# EAGLE design untitled (EAGLE 9.1.3)
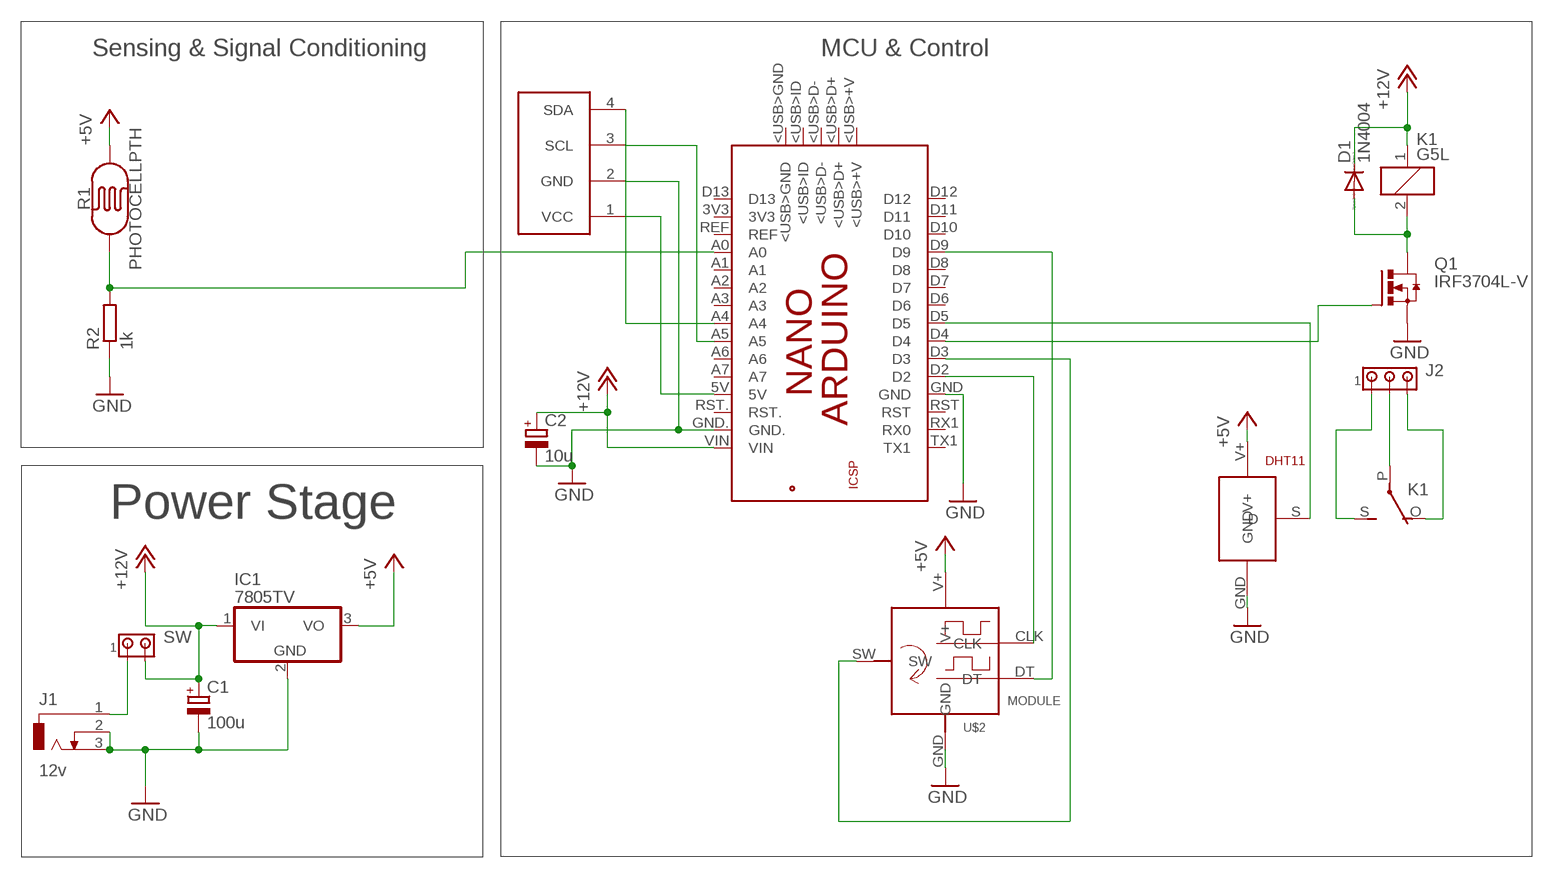
[diagram p0: schematic, sheet 1]

## Parts
C1  100u  CPOL-EUE3.5-8  [E3,5-8]
C2  10u  CPOL-EUE3.5-8  [E3,5-8]
D1  1N4004  [DO41-10]
DHT11  DHT11  [DHT11]
IC1  7805TV  [TO220V]
J1  12v  DCJ0303  [DCJ0303]
J2  MTA03-156  [1X3MTA]
K1  G5L  [G5LE]
PCB1  ARDUINO_NANO  [ARDUINO_NANO]
Q1  IRF3704L-V  [TO262-V]
R1  PHOTOCELLPTH  [PHOTOCELL]
R2  1k  R-EU_0207/7  [0207/7]
SW  MTA02-156  [1X2MTA]
U$1  I2C_OLED  [I2C_OLED_PACKAGE]
U$2  MODULE  [MODULE/SHEILD]

## Nets
+5V: DHT11.V+ IC1.3(VO) R1.2 U$2.V+
+12V: C1.+ C2.+ D1.C IC1.1(VI) K1.1 PCB1.VIN SW.2
GND: C1.- C2.- DHT11.GND IC1.2(GND) J1.2 J1.3 PCB1.GND PCB1.GND. Q1.3(S) R2.1 U$1.2(GND) U$2.GND
N$1: PCB1.A0 R1.1 R2.2
N$2: PCB1.A4 U$1.4(SDA)
N$3: PCB1.A5 U$1.3(SCL)
N$4: J1.1 SW.1
N$5: PCB1.D2 U$2.CLK
N$6: J2.1 K1.S(2:S)
N$7: PCB1.D9 U$2.DT
N$8: J2.2 K1.P(2:P)
N$10: J2.3 K1.O(2:O)
N$11: PCB1.D3 U$2.SW
N$12: DHT11.S(D) PCB1.D5
N$13: PCB1.5V U$1.1(VCC)
N$14: D1.A K1.2 Q1.2(D)
N$15: PCB1.D4 Q1.1(G)
Unconnected: PCB1.3V3 PCB1.5V. PCB1.<USB>+V PCB1.<USB>D+ PCB1.<USB>D- PCB1.<USB>GND PCB1.<USB>ID PCB1.A1 PCB1.A2 PCB1.A3 PCB1.A6 PCB1.A7 PCB1.D6 PCB1.D7 PCB1.D8 PCB1.D10 PCB1.D11 PCB1.D12 PCB1.D13 PCB1.GND_ PCB1.MISO PCB1.MOSI PCB1.REF PCB1.RESET.. PCB1.RST PCB1.RST. PCB1.RX1(RX0) PCB1.SCK PCB1.TX1

## Notes on the sheet
- Sensing & Signal Conditioning | MCU & Control
- Power Stage

## Library data of the parts
C1 C2 = rcl:CPOL-EU: POLARIZED CAPACITOR, European symbol; SPICEPREFIX: C
D1 = diode:1N4004: DIODE general purpose rectifier, 1 A; SPICEPREFIX: D
DHT11 = Misc_Sensors:DHT11
IC1 = linear:78*: Positive VOLTAGE REGULATOR Source: http://cache.national.com/ds/LM/LM78L05.pdf http://www.fairchildsemi.com/ds/LM/LM7805.pdf
J1 = con-jack:DCJ0303: DC POWER JACK Source: DCJ0303.pdf; OC_FARNELL: unknown; OC_NEWARK: unknown
J2 = con-amp:MTA03-156: AMP connector
K1 = relay:G5L: RELAY 1 x switch, 10 A/120 V AC, 8 A/30 V ADC, Omron; OC_FARNELL: unknown; OC_NEWARK: unknown; SPICEPREFIX: B
PCB1 = E14_Arduino_revC:ARDUINO_NANO: Device for representing an Arduino Nano board with a footprint in an EAGLE design. Created by Dave Young for Element14. More EAGLE documentation at: http://www.element14.com/community/community/knode/cadsoft_eagle
Q1 = transistor-power:IRF3704: SMPS MOSFET HEXFET® Power MOSFET Source: http://www.irf.com/product-info/datasheets/data/irf3704.pdf; SPICEPREFIX: Q
R1 = SparkFun-Sensors:PHOTOCELL: Photocell (Photodetector, Photo Resistor, CdS) This is a very small light sensor. A photocell changes (also called a photodetector, photo resistor, CdS or photoconductive cell) resistance depending on the amount of light it is exposed to. These little sensors make great ambient light triggers (when light in the room turns on, do something). Datasheet <http://cdn.sparkfun.com/datasheets/Sensors/LightImaging/SEN-09088.pdf> SparkFun Products Mini Photocell <https://www.sparkfun.com/products/9088> (SEN-09088); PROD_ID: COMP-09129; SF_ID: SEN-09088
R2 = rcl:R-EU_: RESISTOR, European symbol; SPICEPREFIX: R
SW = con-amp:MTA02-156: AMP connector
U$1 = DIYMall_OLED:I2C_OLED
U$2 = rotary-encoder:MODULE

## Board
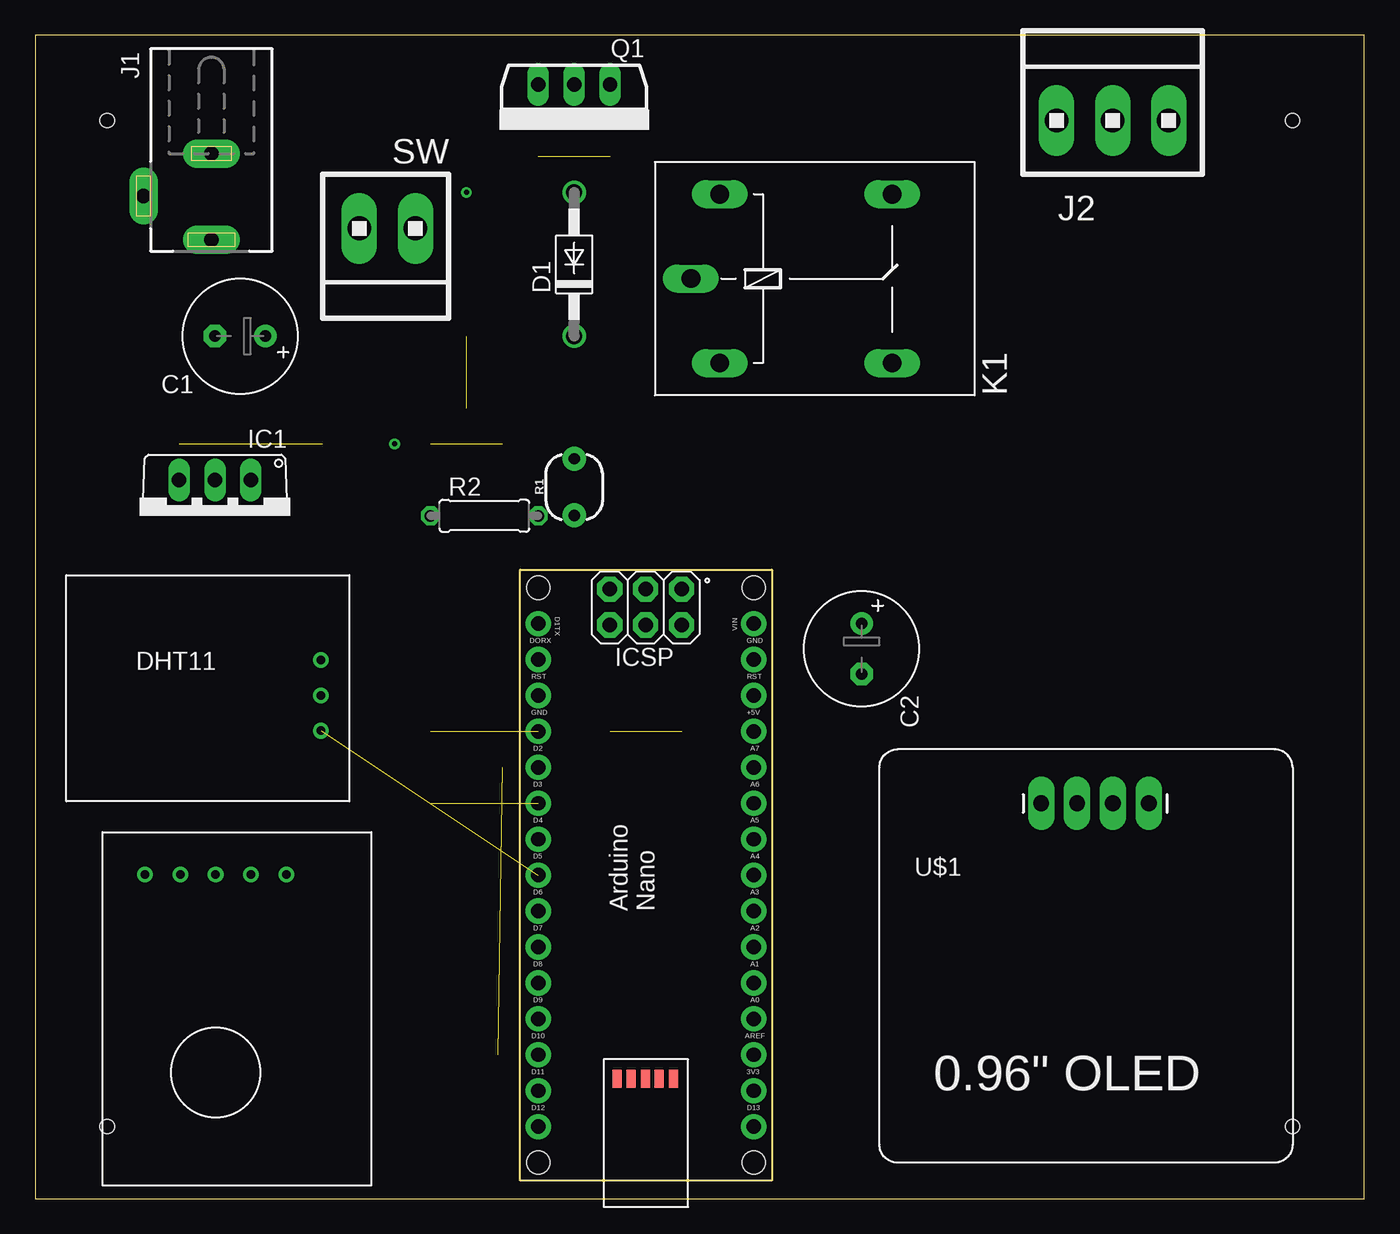
[diagram p1: board, top side]
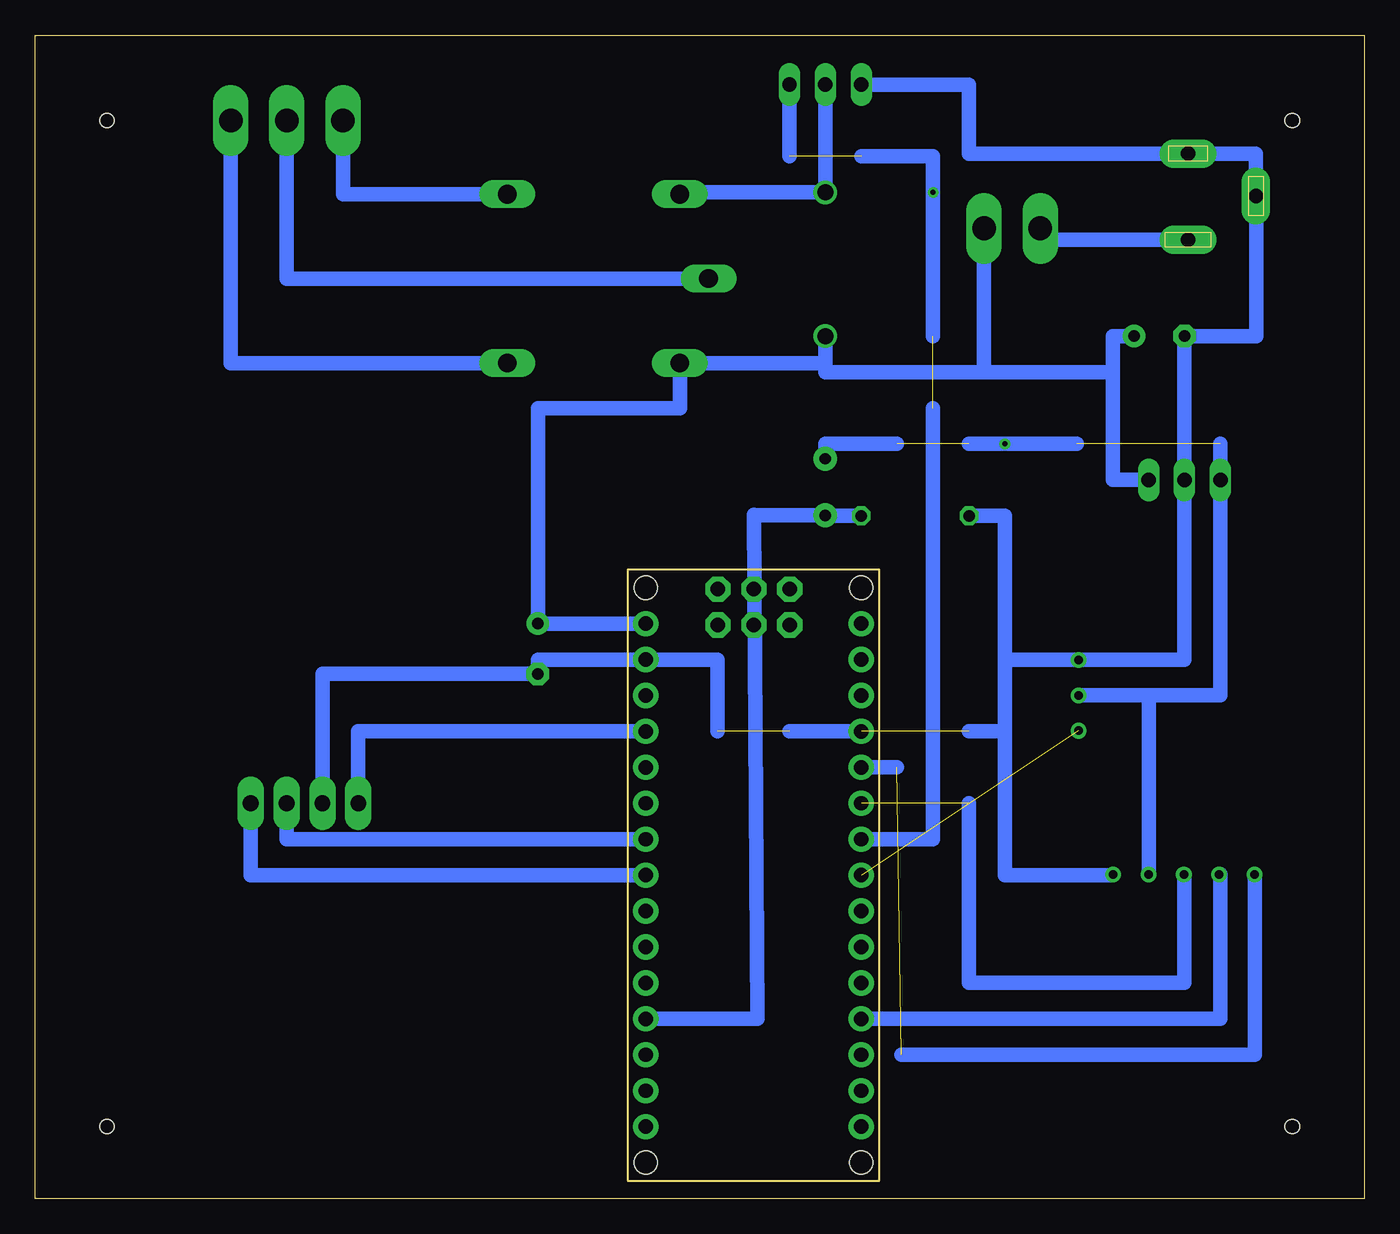
[diagram p2: board, bottom side, seen from below]

Size 93.96 x 82.22 mm. Coordinates in mm from the lower left corner, seen from the top.
Outline: 0,0 93.96,0 93.96,82.22 0,82.22 0,0
Copper layers (1*16): Top 0.035mm / dielectric 1.5mm / Bottom 0.035mm
Design rules "default": minimum track width 6mil, minimum drill 0.35mm, track to track 6mil, track to pad 6mil, pad to pad 6mil, via to via 6mil, smd to smd 6mil, copper to edge 40mil, drill to drill 6mil, minimum pad ring 10mil, minimum via ring 8mil, stop-mask expansion 4mil, vias tented up to drill 0mil, thermal gap 10mil
Holes 1 mm at 88.9,5.08 5.08,5.08 5.08,76.2 88.9,76.2

### Footprints (pad centres in the part's own frame; a part is rotated, then mirrored left to right if it is on the bottom)
E3,5-8 = drill 0.813 pad 1.6: + -1.778,0 | drill 0.813 pad 1.6 octagon: - 1.778,0
DO41-10 = drill 1.118: A 5.08,0; C -5.08,0
DHT11 = drill 0.6: GND 8,2; S 8,-3; V+ 8,-0.5
TO220V = drill 1.016 long: 1 -2.54,-2.54; 2 0,-2.54; 3 2.54,-2.54
DCJ0303 = drill 1 pad 2 long: 1 0,3.1; 2 4.8,0; 3 0,-3
1X3MTA = drill 1.676 long: 1 3.937,0; 2 -0.025,0; 3 -3.988,0
G5LE = drill 1.321 long: 1 -7.493,-5.969; 2 -7.493,5.969; O 4.699,5.969; P -9.525,0; S 4.699,-5.969
ARDUINO_NANO = drill 1.016 pad 1.778: 3V3 6.35,1.27; 5V 31.75,1.27; A0 11.43,1.27; A1 13.97,1.27; A2 16.51,1.27; A3 19.05,1.27; A4 21.59,1.27; A5 24.13,1.27; A6 26.67,1.27; A7 29.21,1.27; D2 29.21,16.51; D3 26.67,16.51; D4 24.13,16.51; D5 21.59,16.51; D6 19.05,16.51; D7 16.51,16.51; D8 13.97,16.51; D9 11.43,16.51; D10 8.89,16.51; D11 6.35,16.51; D12 3.81,16.51; D13 3.81,1.27; GND 31.75,16.51; GND. 36.83,1.27; REF 8.89,1.27; RST 34.29,16.51; RST. 34.29,1.27; RX1 36.83,16.51; TX1 39.37,16.51; VIN 39.37,1.27 | drill 1.016 pad 1.778 octagon: 5V. 39.268,6.375; GND_ 39.268,11.455; MISO 41.808,6.375; MOSI 39.268,8.915; RESET.. 41.808,11.455; SCK 41.808,8.915 | smd 1.27 x 0.635: <USB>+V 7.214,10.947; <USB>D+ 7.214,9.957; <USB>D- 7.214,8.941; <USB>GND 7.214,6.96; <USB>ID 7.214,7.976 | hole 1.651: 1.27,1.27; 1.27,16.51; 41.91,16.51; 41.91,1.27
TO262-V = drill 1.016 long: 1 -2.54,0; 2 0,0; 3 2.54,0
PHOTOCELL = drill 0.8 pad 1.676: 1 -2,0; 2 2,0
0207/7 = drill 0.813 octagon: 1 -3.81,0; 2 3.81,0
1X2MTA = drill 1.676 long: 1 1.981,0; 2 -1.981,0
I2C_OLED_PACKAGE = drill 1.118 pad 1.88 long: 1 0,0; 2 2.54,0; 3 5.08,0; 4 7.62,0
MODULE/SHEILD = drill 0.6: CLK 8,-13; DT 5.5,-13; GND -2,-13; SW 3,-13; V+ 0.5,-13

### Placement (x,y rotation side)
C1  14.48,60.96 180 top
C2  58.42,38.86 270 top
D1  38.1,66.04 90 top
DHT11  12.19,36.07 0 top
IC1  12.7,48.26 180 top
J1  12.45,70.87 180 top
J2  76.2,76.2 0 top
K1  55.88,65.02 0 top
PCB1  52.07,1.27 90 top
Q1  38.1,78.74 180 top
R1  38.1,50.29 90 top
R2  31.75,48.26 0 top
SW  24.89,68.58 180 top
U$1  71.12,27.94 0 top
U$2  15.75,9.91 180 top

### Tracks (layer width: path | path; a pad name or v marks a point on that pad's centre or on a via)
+5V  (via drill 0.35)  (2 unrouted)
  Bottom 1.016: 15.24,35.57 10.16,35.57 IC1.3 10.16,53.34 | U$2.V+ 15.24,35.57 | R1.2 38.1,53.34 33.02,53.34 | DHT11.V+ 15.24,35.57 | 27.94,53.34 v25.4,53.34 20.32,53.34
+12V
  Bottom 1.016: PCB1.VIN C2.+ 58.42,55.88 48.39,55.88 K1.1 38.1,59.05 | IC1.1 17.78,50.8 17.78,58.42 | 17.78,58.42 17.78,60.96 C1.+ | 26.87,58.42 17.78,58.42 | SW.2 26.87,58.42 | 38.1,59.05 D1.C | 26.87,58.42 38.1,58.42 38.1,59.05
GND  (2 unrouted)
  Bottom 1.016: U$1.2 73.66,37.08 C2.- 58.42,38.1 PCB1.GND. 45.72,38.1 45.72,33.02 | 17.78,22.91 U$2.GND 17.75,22.86 25.4,22.86 25.4,33.02 | R2.1 25.4,48.26 25.4,38.1 | PCB1.GND 40.64,33.02 | 25.4,38.1 20.19,38.1 DHT11.GND 12.7,38.07 IC1.2 C1.- 7.62,60.96 7.62,70.87 J1.2 7.65,73.87 J1.3 27.94,73.87 27.94,78.74 Q1.3 | 25.4,33.02 25.4,38.1 | 25.4,33.02 27.94,33.02
N$1
  Bottom 1.016: PCB1.A0 42.91,12.7 43.13,48.34 43.08,48.29 R1.1 38.1,48.26 R2.2
N$2
  Bottom 1.016: PCB1.A4 78.74,22.86 U$1.4
N$3
  Bottom 1.016: PCB1.A5 76.2,25.4 U$1.3
N$4
  Bottom 1.016: J1.1 22.91,67.77 SW.1
N$5  (1 unrouted)
  Bottom 1.016: U$2.CLK 7.75,10.16 32.7,10.16 | PCB1.D2 33.02,30.48
N$6
  Bottom 1.016: K1.S 80.14,59.05 J2.1
N$7
  Bottom 1.016: U$2.DT 10.16,22.91 10.16,12.7 PCB1.D9
N$8
  Bottom 1.016: K1.P 76.17,65.02 J2.2
N$10
  Bottom 1.016: K1.O 72.21,70.99 J2.3
N$11  (1 unrouted)
  Bottom 1.016: U$2.SW 12.7,22.91 12.7,15.24 27.94,15.24 27.94,27.94
N$12  (1 unrouted)
N$13
  Bottom 1.016: PCB1.5V 71.12,33.02 U$1.1
N$14
  Bottom 1.016: Q1.2 D1.A 48.39,71.12 K1.2
N$15  (via drill 0.35)  (2 unrouted)
  Bottom 1.016: PCB1.D4 30.48,25.4 30.48,55.88 | Q1.1 40.64,73.66 | 35.56,73.66 30.48,73.66 v30.48,71.12 30.48,60.96